# EAGLE design board (EAGLE 9.6.2)
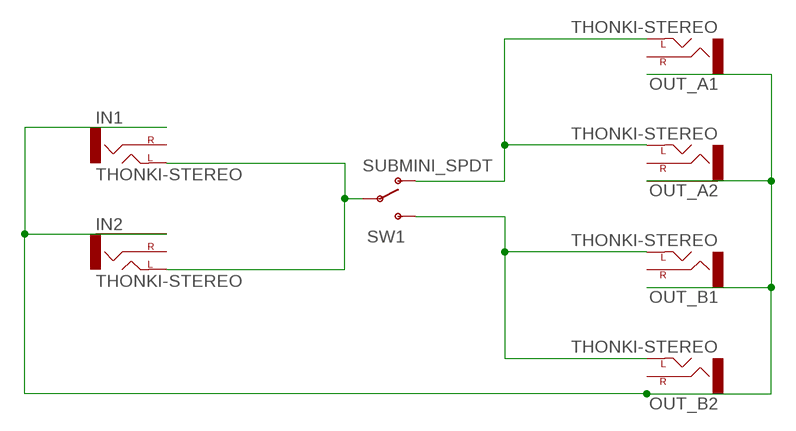
[diagram p0: schematic, sheet 1]

## Parts
IN1  THONKI-STEREO  [WQP-PJ366ST_JACK]
IN2  THONKI-STEREO  [WQP-PJ366ST_JACK]
OUT_A1  THONKI-STEREO  [WQP-PJ366ST_JACK]
OUT_A2  THONKI-STEREO  [WQP-PJ366ST_JACK]
OUT_B1  THONKI-STEREO  [WQP-PJ366ST_JACK]
OUT_B2  THONKI-STEREO  [WQP-PJ366ST_JACK]
SW1  SUBMINI_SPDT  [SUBMINI_TOGGLE]

## Nets
N$1: IN1.P$1_TIP(LEFT) IN2.P$1_TIP(LEFT) SW1.COM(COMMON)
N$2: OUT_A1.P$1_TIP(LEFT) OUT_A2.P$1_TIP(LEFT) SW1.1(O)
N$3: OUT_B1.P$1_TIP(LEFT) OUT_B2.P$1_TIP(LEFT) SW1.3(S)
N$6: IN1.P$3_SLEEVE(SLEEVE) IN2.P$3_SLEEVE(SLEEVE) OUT_A1.P$3_SLEEVE(SLEEVE) OUT_A2.P$3_SLEEVE(SLEEVE) OUT_B1.P$3_SLEEVE(SLEEVE) OUT_B2.P$3_SLEEVE(SLEEVE)
Unconnected: IN1.P$2_SWITCH(RIGHT) IN2.P$2_SWITCH(RIGHT) OUT_A1.P$2_SWITCH(RIGHT) OUT_A2.P$2_SWITCH(RIGHT) OUT_B1.P$2_SWITCH(RIGHT) OUT_B2.P$2_SWITCH(RIGHT)

## Library data of the parts
IN1 IN2 OUT_A1 OUT_A2 OUT_B1 OUT_B2 = MusicThingModular:THONKI-STEREO: 3.5mm socket for Eurorack modular synths
SW1 = MusicThingModular:SUBMINI_SPDT

## Board
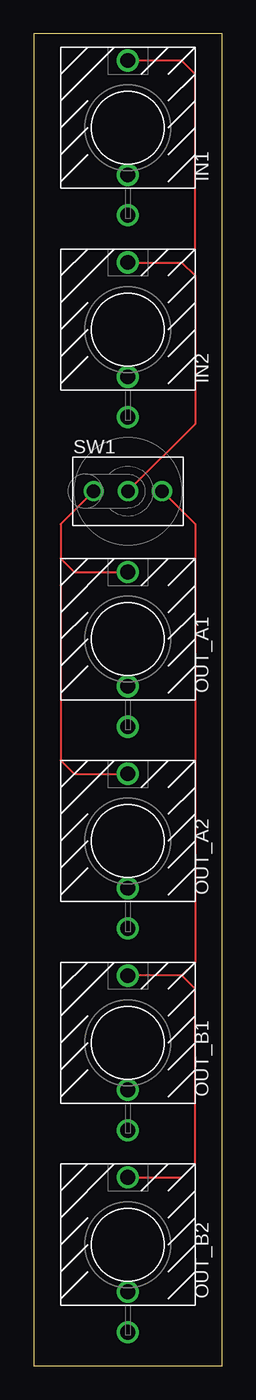
[diagram p1: board, top side]
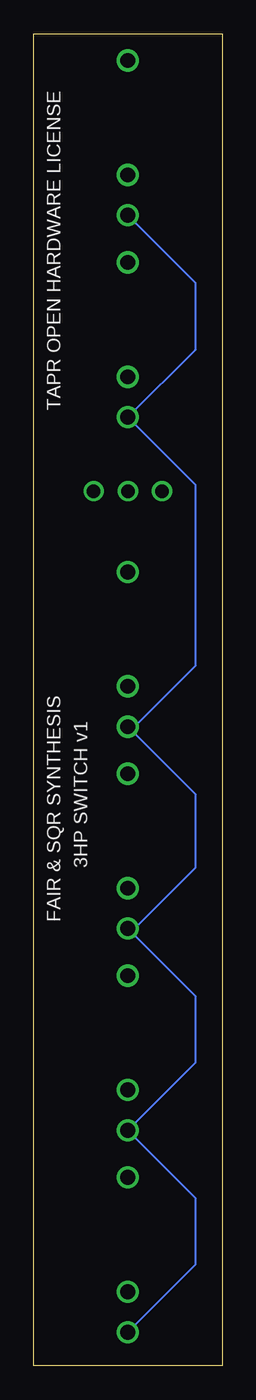
[diagram p2: board, bottom side, seen from below]

Size 14 x 99 mm. Coordinates in mm from the lower left corner, seen from the top.
Outline: 0,0 14,0 14,99 0,99 0,0
Copper layers (1*16): Top 0.035mm / dielectric 1.5mm / Bottom 0.035mm
Design rules "default": minimum track width 6mil, minimum drill 0.35mm, track to track 6mil, track to pad 6mil, pad to pad 6mil, via to via 6mil, smd to smd 6mil, copper to edge 40mil, drill to drill 6mil, minimum pad ring 10mil, minimum via ring 8mil, stop-mask expansion 4mil, vias tented up to drill 0mil, thermal gap 10mil

### Footprints (pad centres in the part's own frame; a part is rotated, then mirrored left to right if it is on the bottom)
WQP-PJ366ST_JACK = drill 1.1: P$1_TIP 0,5; P$2_SWITCH 0,-3.5; P$3_SLEEVE 0,-6.5
SUBMINI_TOGGLE = drill 1 pad 1.422: 1 -2.54,0; 3 2.54,0; COM 0,0

### Placement (x,y rotation side)
IN1  7,92 0 top
IN2  7,77 0 top
OUT_A1  7,54 0 top
OUT_A2  7,39 0 top
OUT_B1  7,24 0 top
OUT_B2  7,9 0 top
SW1  7,65 0 top

### Tracks (layer width: path | path; a pad name or v marks a point on that pad's centre or on a via)
N$1
  Top 0.152: IN2.P$1_TIP 11,82 | 11,82 12,81 12,70 SW1.COM | 11,82 12,83 12,96 11,97 IN1.P$1_TIP
N$2
  Top 0.152: SW1.1 2,62.54 2,60 3,59 | 3,59 OUT_A1.P$1_TIP | 3,59 2,58 2,45 3,44 OUT_A2.P$1_TIP
N$3
  Top 0.152: SW1.3 12,62.54 12,30 11,29 | OUT_B2.P$1_TIP 11,14 12,15 12,28 11,29 | 11,29 OUT_B1.P$1_TIP
N$6
  Bottom 0.152: IN1.P$3_SLEEVE 2,80.5 2,75.5 IN2.P$3_SLEEVE 2,65.5 2,52 6.5,47.5 OUT_A1.P$3_SLEEVE 2,42.5 2,37 6.5,32.5 OUT_A2.P$3_SLEEVE 2,27.5 2,22.5 OUT_B1.P$3_SLEEVE 2,12.5 2,7.5 OUT_B2.P$3_SLEEVE

### Text on the board
bPlace: TAPR OPEN HARDWARE LICENSE | 3HP SWITCH v1 | FAIR & SQR SYNTHESIS